# Altium schematic sheet STlink-V3EC.SchDoc: STLINK-V3EC
size A3; Date: Not used; ApprovedBy: Not used; CheckedBy: Not used; Author: Not used; CompanyName: STMicroelectronics; DrawnBy: Not used; Engineer: Not used; Organization: Not used; Address1: Not used; Address2: Not used; Address3: Not used; Address4: Not used; DocumentNumber: Not used; Revision: Not used; SheetNumber: 6; SheetTotal: 7; CurrentTime: Not used; CurrentDate: Not used; Time: Not used; DocumentFullPathAndName: Not used; DocumentName: Not used; ModifiedDate: Not used; ImagePath: Not used; ProjectName: Not used; Application_BuildNumber: Not used
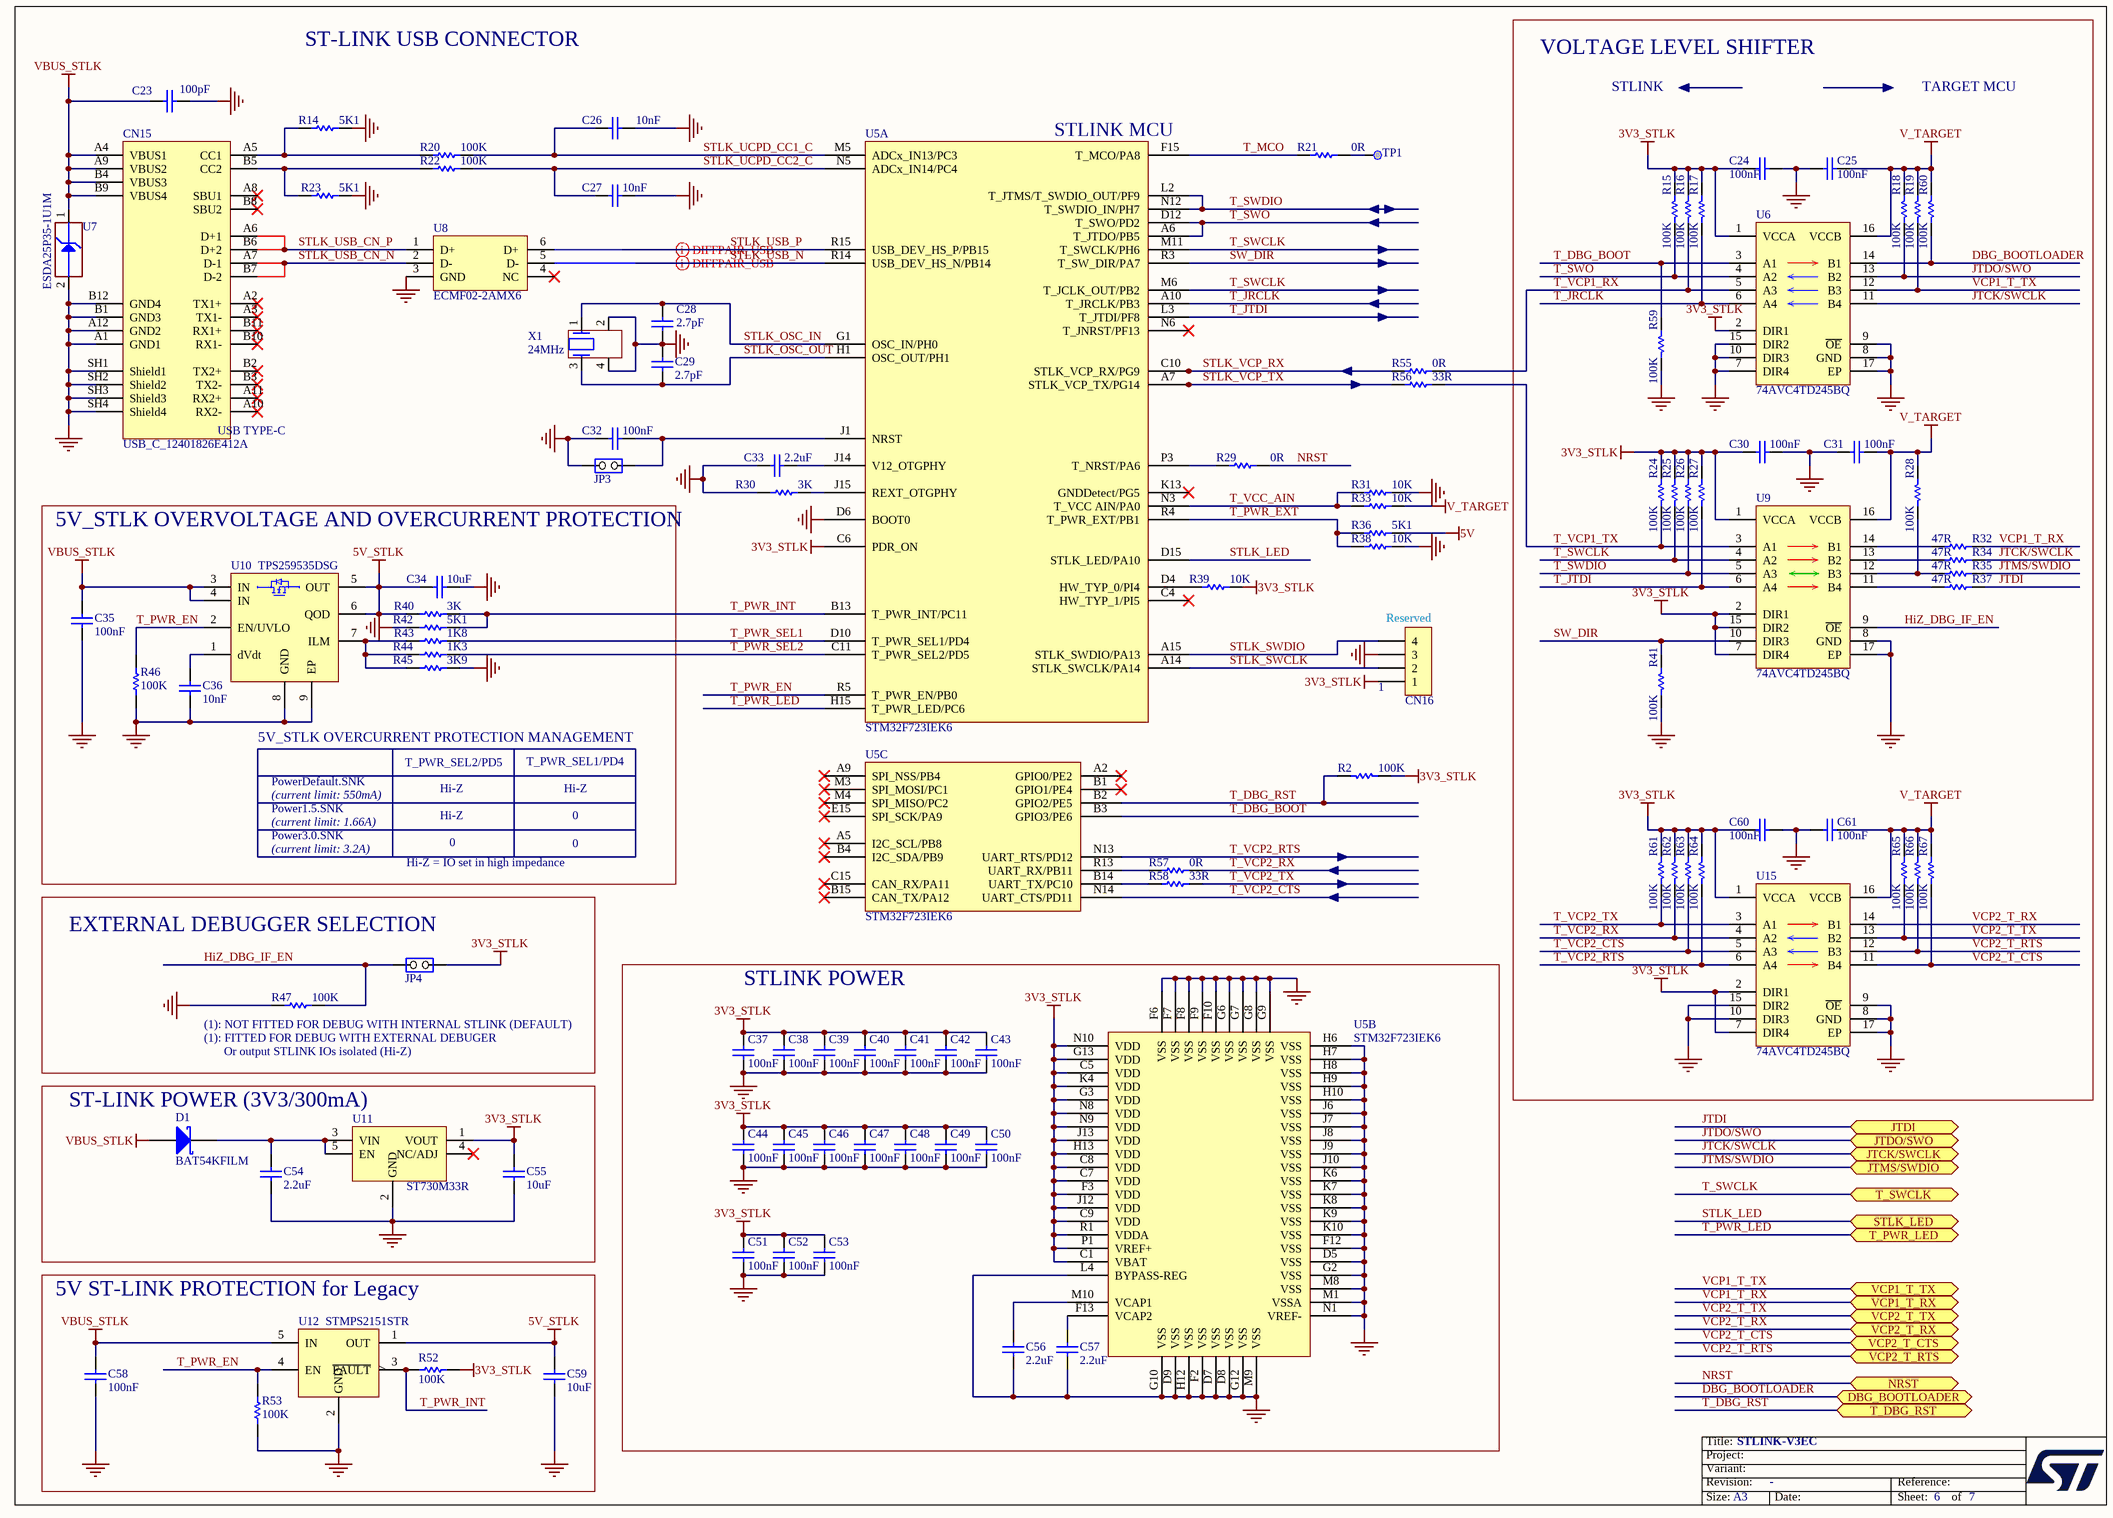
[diagram p0: STlink-V3EC.SchDoc]

## Parts
C23  value 100pF  [C0402]  (hidden comment: Capacitor)
C24  value 100nF  [C0402]  (hidden comment: Capacitor)
C25  value 100nF  [C0402]  (hidden comment: Capacitor)
C26  value 10nF  [C0402]  (hidden comment: Capacitor)
C27  value 10nF  [C0402]  (hidden comment: Capacitor)
C28  value 2.7pF  [C0402]  (hidden comment: Capacitor)
C29  value 2.7pF  [C0402]  (hidden comment: Capacitor)
C30  value 100nF  [C0402]  (hidden comment: Capacitor)
C31  value 100nF  [C0402]  (hidden comment: Capacitor)
C32  value 100nF  [C0402]  (hidden comment: Capacitor)
C33  value 2.2uF  [C0402]  (hidden comment: Capacitor)
C34  value 10uF  [C0603]  (hidden comment: Capacitor)
C35  value 100nF  [C0402]  (hidden comment: Capacitor)
C36  value 10nF  [C0402]  (hidden comment: Capacitor)
C37  value 100nF  [C0402]  (hidden comment: Capacitor)
C38  value 100nF  [C0402]  (hidden comment: Capacitor)
C39  value 100nF  [C0402]  (hidden comment: Capacitor)
C40  value 100nF  [C0402]  (hidden comment: Capacitor)
C41  value 100nF  [C0402]  (hidden comment: Capacitor)
C42  value 100nF  [C0402]  (hidden comment: Capacitor)
C43  value 100nF  [C0402]  (hidden comment: Capacitor)
C44  value 100nF  [C0402]  (hidden comment: Capacitor)
C45  value 100nF  [C0402]  (hidden comment: Capacitor)
C46  value 100nF  [C0402]  (hidden comment: Capacitor)
C47  value 100nF  [C0402]  (hidden comment: Capacitor)
C48  value 100nF  [C0402]  (hidden comment: Capacitor)
C49  value 100nF  [C0402]  (hidden comment: Capacitor)
C50  value 100nF  [C0402]  (hidden comment: Capacitor)
C51  value 100nF  [C0402]  (hidden comment: Capacitor)
C52  value 100nF  [C0402]  (hidden comment: Capacitor)
C53  value 100nF  [C0402]  (hidden comment: Capacitor)
C54  value 2.2uF  [C0805]  (hidden comment: Capacitor)
C55  value 10uF  [C0603]  (hidden comment: Capacitor)
C56  value 2.2uF  [C0402]  (hidden comment: Capacitor)
C57  value 2.2uF  [C0402]  (hidden comment: Capacitor)
C58  value 100nF  [C0402]  (hidden comment: Capacitor)
C59  value 10uF  [C0603]  (hidden comment: Capacitor)
C60  value 100nF  [C0402]  (hidden comment: Capacitor)
C61  value 100nF  [C0402]  (hidden comment: Capacitor)
CN15  value USB_C_12401826E412A  [CON_USB-TYPEC_AMPHENOL_12401826E412A]  (hidden comment: USB_TYPE_C_Receptacle)
CN16  Header 4x1  [CON_SAMTEC_TSW-104-07-G-S]  (value not drawn)
D1  value BAT54KFILM  [DIO_SOD523_1A_2K]  (hidden comment: SCHOTTKY_1A_2K)
JP3  Jumper_Header 2x1  [CON_SAMTEC_TSW-102-07-G-S]  (value not drawn)
JP4  Jumper_Header 2x1  [CON_SAMTEC_TSW-102-07-G-S]  (value not drawn)
R2  value 100K  [R0402]  (hidden comment: Resistor)
R14  value 5K1  [R0402]  (hidden comment: Resistor)
R15  value 100K  [R0402]  (hidden comment: Resistor)
R16  value 100K  [R0402]  (hidden comment: Resistor)
R17  value 100K  [R0402]  (hidden comment: Resistor)
R18  value 100K  [R0402]  (hidden comment: Resistor)
R19  value 100K  [R0402]  (hidden comment: Resistor)
R20  value 100K  [R0402]  (hidden comment: Resistor)
R21  value 0R  [R0402]  (hidden comment: Resistor)
R22  value 100K  [R0402]  (hidden comment: Resistor)
R23  value 5K1  [R0402]  (hidden comment: Resistor)
R24  value 100K  [R0402]  (hidden comment: Resistor)
R25  value 100K  [R0402]  (hidden comment: Resistor)
R26  value 100K  [R0402]  (hidden comment: Resistor)
R27  value 100K  [R0402]  (hidden comment: Resistor)
R28  value 100K  [R0402]  (hidden comment: Resistor)
R29  value 0R  [R0402]  (hidden comment: Resistor)
R30  value 3K  [R0402]  (hidden comment: Resistor)
R31  value 10K  [R0402]  (hidden comment: Resistor)
R32  value 47R  [R0402]  (hidden comment: Resistor)
R33  value 10K  [R0402]  (hidden comment: Resistor)
R34  value 47R  [R0402]  (hidden comment: Resistor)
R35  value 47R  [R0402]  (hidden comment: Resistor)
R36  value 5K1  [R0402]  (hidden comment: Resistor)
R37  value 47R  [R0402]  (hidden comment: Resistor)
R38  value 10K  [R0402]  (hidden comment: Resistor)
R39  value 10K  [R0402]  (hidden comment: Resistor)
R40  value 3K  [R0402]  (hidden comment: Resistor)
R41  value 100K  [R0402]  (hidden comment: Resistor)
R42  value 5K1  [R0402]  (hidden comment: Resistor)
R43  value 1K8  [R0402]  (hidden comment: Resistor)
R44  value 1K3  [R0402]  (hidden comment: Resistor)
R45  value 3K9  [R0402]  (hidden comment: Resistor)
R46  value 100K  [R0402]  (hidden comment: Resistor)
R47  value 100K  [R0402]  (hidden comment: Resistor)
R52  value 100K  [R0402]  (hidden comment: Resistor)
R53  value 100K  [R0402]  (hidden comment: Resistor)
R55  value 0R  [R0402]  (hidden comment: Resistor)
R56  value 33R  [R0402]  (hidden comment: Resistor)
R57  value 0R  [R0402]  (hidden comment: Resistor)
R58  value 33R  [R0402]  (hidden comment: Resistor)
R59  value 100K  [R0402]  (hidden comment: Resistor)
R60  value 100K  [R0402]  (hidden comment: Resistor)
R61  value 100K  [R0402]  (hidden comment: Resistor)
R62  value 100K  [R0402]  (hidden comment: Resistor)
R63  value 100K  [R0402]  (hidden comment: Resistor)
R64  value 100K  [R0402]  (hidden comment: Resistor)
R65  value 100K  [R0402]  (hidden comment: Resistor)
R66  value 100K  [R0402]  (hidden comment: Resistor)
R67  value 100K  [R0402]  (hidden comment: Resistor)
TP1  Test Point  [TP_SMD_1MM]  (value not drawn)  (no BOM)
U5  value STM32F723IEK6  [ICC_UFBGA201_176+25_10X10_P065]  (hidden comment: STLINK-V3EC_Old)  (parts A,B,C of 3)
U6  74AVC4TD245BQ  [ICC_DHVQFN16-EPAD_SOT763-1_2P5X3P5_H0P85_P050]
U7  value ESDA25P35-1U1M  [ESD_QFN1610_2N_1K_2A]  (hidden comment: ESD-TRANSIL)
U8  ECMF02-2AMX6  [ESD_QFN-6L_1P7X1P5_P050]
U9  74AVC4TD245BQ  [ICC_DHVQFN16-EPAD_SOT763-1_2P5X3P5_H0P85_P050]
U10  TPS259535DSG  [ICC_WSON8-EPAD_2X2_P050]
U11  ST730M33R  [ICC_SOT23-5L_H1P45]
U12  STMPS2151STR  [MOS_SOT23-5L]
U15  74AVC4TD245BQ  [ICC_DHVQFN16-EPAD_SOT763-1_2P5X3P5_H0P85_P050]
X1  value 24MHz  [CRY_NX2016SA_4P]  (hidden comment: XTAL_4_PINS)

## Blocks framed on the sheet
VOLTAGE LEVEL SHIFTER: C24 C25 C30 C31 C60 C61 R15-R19 R24-R28 R32 R34 R35 R37 R41 R59-R67 U6 U9 U15
5V_STLK OVERVOLTAGE AND OVERCURRENT PROTECTION: C34-C36 R40 R42-R46 U10
EXTERNAL DEBUGGER SELECTION: JP4 R47
STLINK POWER: C37-C53 C56 C57 U5
ST-LINK POWER (3V3/300mA): C54 C55 D1 U11
5V ST-LINK PROTECTION for Legacy: C58 C59 R52 R53 U12

## Ports
DBG_BOOTLOADER (bidir), JTCK/SWCLK (bidir), JTDI (bidir), JTDO/SWO (bidir), JTMS/SWDIO (bidir), NRST (bidir), STLK_LED (bidir), T_DBG_RST (bidir), T_PWR_LED (bidir), T_SWCLK (bidir), VCP1_T_RX (bidir), VCP1_T_TX (bidir), VCP2_T_CTS (bidir), VCP2_T_RTS (bidir), VCP2_T_RX (bidir), VCP2_T_TX (bidir)

## Nets
3V3_STLK: C24.2 C30.2 C37.1 C38.1 C39.1 C40.1 C41.1 C42.1 C43.1 C44.1 C45.1 C46.1 C47.1 C48.1 C49.1 C50.1 C51.1 C52.1 C53.1 C55.2 C60.2 CN16.1 JP4.1(COMMON) R2.1 R15.2 R16.2 R17.2 R24.1 R25.2 R26.2 R27.2 R39.2 R52.1 R61.2 R62.2 R63.2 R64.2 U5.C1(VBAT) U5.C5(VDD) U5.C6(PDR_ON) U5.C7(VDD) U5.C8(VDD) U5.C9(VDD) U5.F3(VDD) U5.G3(VDD) U5.G13(VDD) U5.H13(VDD) U5.J12(VDD) U5.J13(VDD) U5.K4(VDD) U5.N8(VDD) U5.N9(VDD) U5.N10(VDD) U5.P1(VREF+) U5.R1(VDDA) U6.1(VCCA) U6.2(DIR1) U9.1(VCCA) U9.2(DIR1) U9.7(DIR4) U9.15(DIR2) U11.1(VOUT) U15.1(VCCA) U15.2(DIR1) U15.7(DIR4)
5V: R36.2
5V_STLK: C34.2 C59.2 R40.1 U10.5(OUT) U10.6(QOD) U12.1(OUT)
GND: C23.2 C24.1 C25.2 C26.2 C27.2 C28.1 C29.2 C30.1 C31.2 C32.1 C33.1 C34.1 C35.1 C36.1 C37.2 C38.2 C39.2 C40.2 C41.2 C42.2 C43.2 C44.2 C45.2 C46.2 C47.2 C48.2 C49.2 C50.2 C51.2 C52.2 C53.2 C54.1 C55.1 C56.1 C57.1 C58.1 C59.1 C60.1 C61.2 CN15.A1(GND1) CN15.A12(GND2) CN15.B1(GND3) CN15.B12(GND4) CN15.SH1(Shield1) CN15.SH2(Shield2) CN15.SH3(Shield3) CN15.SH4(Shield4) CN16.3 JP3.2(NO) R14.2 R23.2 R30.2 R31.2 R38.2 R41.1 R42.1 R45.2 R46.1 R47.1 R53.1 R59.1 U5.D5(VSS) U5.D6(BOOT0) U5.D7(VSS) U5.D8(VSS) U5.D9(VSS) U5.F2(VSS) U5.F6(VSS) U5.F7(VSS) U5.F8(VSS) U5.F9(VSS) U5.F10(VSS) U5.F12(VSS) U5.G2(VSS) U5.G6(VSS) U5.G7(VSS) U5.G8(VSS) U5.G9(VSS) U5.G10(VSS) U5.G12(VSS) U5.H6(VSS) U5.H7(VSS) U5.H8(VSS) U5.H9(VSS) U5.H10(VSS) U5.H12(VSS) U5.J6(VSS) U5.J7(VSS) U5.J8(VSS) U5.J9(VSS) U5.J10(VSS) U5.K6(VSS) U5.K7(VSS) U5.K8(VSS) U5.K9(VSS) U5.K10(VSS) U5.L4(BYPASS-REG) U5.M1(VSSA) U5.M8(VSS) U5.M9(VSS) U5.N1(VREF-) U6.7(DIR4) U6.8(GND) U6.9(~{OE}) U6.10(DIR3) U6.15(DIR2) U6.17(EP) U7.2(GND) U8.3(GND) U9.8(GND) U9.17(EP) U10.8(GND) U10.9(EP) U11.2(GND) U12.2(GND) U15.8(GND) U15.9(~{OE}) U15.10(DIR3) U15.15(DIR2) U15.17(EP) X1.2 X1.4
V_TARGET: C25.1 C31.1 C61.1 R18.2 R19.2 R28.2 R33.2 R60.2 R65.2 R66.2 R67.2 U6.16(VCCB) U9.16(VCCB) U15.16(VCCB)
VBUS_STLK: C23.1 C35.2 C58.2 CN15.A4(VBUS1) CN15.A9(VBUS2) CN15.B4(VBUS3) CN15.B9(VBUS4) D1.1(A) U7.1(IO1) U10.3(IN) U10.4(IN) U12.5(IN)
DBG_BOOTLOADER: R60.1 U6.14(B1) ; port DBG_BOOTLOADER
HiZ_DBG_IF_EN: JP4.2(NO) R47.2 U9.9(~{OE})
JTCK/SWCLK: R34.2 U6.11(B4) ; port JTCK/SWCLK
JTDI: R37.2 ; port JTDI
JTDO/SWO: R18.1 U6.13(B2) ; port JTDO/SWO
JTMS/SWDIO: R35.2 ; port JTMS/SWDIO
NRST: R29.2 ; port NRST
STLK_LED: U5.D15(STLK_LED/PA10) ; port STLK_LED
STLK_OSC_IN: C28.2 U5.G1(OSC_IN/PH0) X1.1
STLK_OSC_OUT: C29.1 U5.H1(OSC_OUT/PH1) X1.3
STLK_SWCLK: CN16.2 U5.A14(STLK_SWCLK/PA14)
STLK_SWDIO: CN16.4 U5.A15(STLK_SWDIO/PA13)
STLK_UCPD_CC1_C: C26.1 R20.2 U5.M5(ADCx_IN13/PC3)
STLK_UCPD_CC2_C: C27.1 R22.2 U5.N5(ADCx_IN14/PC4)
STLK_USB_CN_N: CN15.A7(D-1) CN15.B7(D-2) U8.2(D-)
STLK_USB_CN_P: CN15.A6(D+1) CN15.B6(D+2) U8.1(D+)
STLK_USB_N: U5.R14(USB_DEV_HS_N/PB14) U8.5(D-)
STLK_USB_P: U5.R15(USB_DEV_HS_P/PB15) U8.6(D+)
STLK_VCP_RX: R55.1 U5.C10(STLK_VCP_RX/PG9)
STLK_VCP_TX: R56.1 U5.A7(STLK_VCP_TX/PG14)
SW_DIR: R41.2 U5.R3(T_SW_DIR/PA7) U9.10(DIR3)
T_DBG_BOOT: R59.2 U5.B3(GPIO3/PE6) U6.3(A1)
T_DBG_RST: R2.2 U5.B2(GPIO2/PE5) ; port T_DBG_RST
T_JRCLK: R17.1 U5.A10(T_JRCLK/PB3) U6.6(A4)
T_JTDI: R27.1 U5.L3(T_JTDI/PF8) U9.6(A4)
T_MCO: R21.1 U5.F15(T_MCO/PA8)
T_PWR_EN: R46.2 R53.2 U5.R5(T_PWR_EN/PB0) U10.2(EN/UVLO) U12.4(EN)
T_PWR_EXT: R36.1 R38.1 U5.R4(T_PWR_EXT/PB1)
T_PWR_INT: R40.2 R42.2 R52.2 U5.B13(T_PWR_INT/PC11) U12.3(~{FAULT})
T_PWR_LED: U5.H15(T_PWR_LED/PC6) ; port T_PWR_LED
T_PWR_SEL1: R43.2 U5.D10(T_PWR_SEL1/PD4)
T_PWR_SEL2: R44.2 U5.C11(T_PWR_SEL2/PD5)
T_SWCLK: R25.1 U5.M6(T_JCLK_OUT/PB2) U5.M11(T_SWCLK/PH6) U9.4(A2) ; port T_SWCLK
T_SWDIO: R26.1 U5.L2(T_JTMS/T_SWDIO_OUT/PF9) U5.N12(T_SWDIO_IN/PH7) U9.5(A3)
T_SWO: R15.1 U5.A6(T_JTDO/PB5) U5.D12(T_SWO/PD2) U6.4(A2)
T_VCC_AIN: R31.1 R33.1 U5.N3(T_VCC_AIN/PA0)
T_VCP1_RX: R16.1 R55.2 U6.5(A3)
T_VCP1_TX: R24.2 R56.2 U9.3(A1)
T_VCP2_CTS: R63.1 U5.N14(UART_CTS/PD11) U15.5(A3)
T_VCP2_RTS: R64.1 U5.N13(UART_RTS/PD12) U15.6(A4)
T_VCP2_RX: R57.2 R62.1 U15.4(A2)
T_VCP2_TX: R58.2 R61.1 U15.3(A1)
VCP1_T_RX: R32.2 ; port VCP1_T_RX
VCP1_T_TX: R19.1 U6.12(B3) ; port VCP1_T_TX
VCP2_T_CTS: R67.1 U15.11(B4) ; port VCP2_T_CTS
VCP2_T_RTS: R66.1 U15.12(B3) ; port VCP2_T_RTS
VCP2_T_RX: U15.14(B1) ; port VCP2_T_RX
VCP2_T_TX: R65.1 U15.13(B2) ; port VCP2_T_TX
NetC32_2: C32.2 JP3.1(COMMON) U5.J1(NRST)
NetC33_2: C33.2 U5.J14(V12_OTGPHY)
NetC36_2: C36.2 U10.1(dVdt)
NetC54_2: C54.2 D1.2(K) U11.3(VIN) U11.5(EN)
NetC56_2: C56.2 U5.M10(VCAP1)
NetC57_2: C57.2 U5.F13(VCAP2)
NetCN15_A5: CN15.A5(CC1) R14.1 R20.1
NetCN15_B5: CN15.B5(CC2) R22.1 R23.1
NetR21_2: R21.2 TP1.1
NetR28_1: R28.1 R35.1 U9.12(B3)
NetR29_1: R29.1 U5.P3(T_NRST/PA6)
NetR30_1: R30.1 U5.J15(REXT_OTGPHY)
NetR32_1: R32.1 U9.14(B1)
NetR34_1: R34.1 U9.13(B2)
NetR37_1: R37.1 U9.11(B4)
NetR39_1: R39.1 U5.D4(HW_TYP_0/PI4)
NetR43_1: R43.1 R44.1 R45.1 U10.7(ILM)
NetR57_1: R57.1 U5.R13(UART_RX/PB11)
NetR58_1: R58.1 U5.B14(UART_TX/PC10)

Not connected (* = marked no-connect by the designer): CN15 A2(TX1+)* A3(TX1-)* A8(SBU1)* A10(RX2-)* A11(RX2+)* B2(TX2+)* B3(TX2-)* B8(SBU2)* B10(RX1-)* B11(RX1+)*; U5 A2(GPIO0/PE2)* A5(I2C_SCL/PB8)* A9(SPI_NSS/PB4)* B1(GPIO1/PE4)* B4(I2C_SDA/PB9)* B15(CAN_TX/PA12)* C4(HW_TYP_1/PI5)* C15(CAN_RX/PA11)* E15(SPI_SCK/PA9)* K13(GNDDetect/PG5)* M3(SPI_MOSI/PC1)* M4(SPI_MISO/PC2)* N6(T_JNRST/PF13)*; U8 4(NC)*; U11 4(NC/ADJ)*

## Layout directives
differential pair; rule Impedance Constraint [Min = 85.00    Max = 95.00    ]: STLK_USB_N, STLK_USB_P

## Notes on the sheet
- ST-LINK USB CONNECTOR
- STLINK
- TARGET MCU
- (near U5) STLINK MCU
- (near CN16) Reserved
- (near CN16) 1
- 5V_STLK OVERCURRENT PROTECTION MANAGEMENT
- PowerDefault.SNK
- T_PWR_SEL2/PD5
- T_PWR_SEL1/PD4
- (current limit: 550mA)
- (current limit: 1.66A)
- (current limit: 3.2A)
- Power1.5.SNK
- Power3.0.SNK
- Hi-Z
- 0
- Hi-Z = IO set in high impedance
- (near R47) (1): NOT FITTED FOR DEBUG WITH INTERNAL STLINK (DEFAULT)
- (near R47) (1): FITTED FOR DEBUG WITH EXTERNAL DEBUGER
- (near R47) Or output STLINK IOs isolated (Hi-Z)
- Title:
- Project:
- Size:
- Revision:
- Variant:
- A3
- -
- Date:
- Reference:
- Sheet:
- of
- (in symbol MCD-03232) USB TYPE-C

## Library data of the parts
C23 = MCD-00205: Capacitor, MLCC, 100pF, 50V, NPO, +/-5%, 0402, T=0.5mm; Part_Preference: Recommended; Manufacturer: YAGEO; Manufacturer_Part_Number: CC0402JRNPO9BN101; Component_Country_Of_Origin: China; Internal_Part_Number: MCD-00205; Status: Released; Part_Type: Capacitor; Package: 0402; ComponentLink1URL: http://tunmcdsvn.tun.st.com/Component_Documentation_Library/Trunk/Capacitor/YAGEO_NP0_Series; Order_Code_Digikey: 311-1024-1-ND; Order_Code_Farnell: 3019226RL; Order_Code_RS: N/A
C24 C25 C30-C32 C37-C53 C60 C61 = MCD-00006: Capacitor, MLCC, 100nF, 16V, X7R, 10%, 0402, T=0.5mm; Manufacturer_Part_Number: CC0402KRX7R7BB104; Manufacturer: YAGEO; Alternate_Manufacturer_Part_Number: GCM155R71C104KA55D; Alternate_Manufacturer: MURATA; Provided_By: SUBCO; Internal_Part_Number: MCD-00006; ComponentLink1Description: Datasheet; Status: Released; Package: C0402; Part_Type: Capacitor; ComponentLink1URL: http://tunmcdsvn.tun.st.com/Component_Datasheet_Library/Trunk/Capacitors/Yageo_Multilayer_Capacitor_X7R_series_100pF_to_22uF
C26 C27 C36 = MCD-02198: Capacitor, MLCC, 10nF, 50V, X7R, +/-10%, 0402, T=0.5mm; Part_Preference: Recommended; Manufacturer: YAGEO; Manufacturer_Part_Number: CC0402KRX7R9BB103; Order_Code_RS: 6169644; Component_Country_Of_Origin: China; Internal_Part_Number: MCD-02198; Status: Checked; Part_Type: Capacitor; Package: 0402; ComponentLink1URL: http://tunmcdsvn.tun.st.com/Component_Documentation_Library/Trunk/Capacitor/YAGEO_X7R_Series; Order_Code_Digikey: N/A; Order_Code_Farnell: N/A
C28 C29 = MCD-01774: Capacitor, MLCC, 2.7pF, 50V, NPO, +/-0.1pF, 0402, T=0.5mm; Part_Preference: Recommended; Manufacturer: YAGEO; Manufacturer_Part_Number: CC0402BRNPO9BN2R7; Component_Country_Of_Origin: China; Internal_Part_Number: MCD-01774; Status: Released; Part_Type: Capacitor; Package: 0402; ComponentLink1URL: http://tunmcdsvn.tun.st.com/Component_Documentation_Library/Trunk/Capacitor/YAGEO_NP0_Series; Order_Code_Digikey: 311-1619-1-ND; Order_Code_Farnell: N/A; Order_Code_RS: N/A
C33 C56 C57 = MCD-02606: Capacitor, MLCC, 2.2uF, 6.3V, X5R, +/-10%, 0402, T=0.5mm; Part_Preference: Recommended; Manufacturer: YAGEO; Manufacturer_Part_Number: CC0402KRX5R5BB225; Order_Code_RS: 1992205; Internal_Part_Number: MCD-02606; Status: New; Part_Type: Capacitor; Package: 0402; ComponentLink1URL: http://tunmcdsvn.tun.st.com/Component_Documentation_Library/Trunk/Capacitor/YAGEO_X5R_Series; Order_Code_Digikey: 311-1682-2-ND; Order_Code_Farnell: 3366429
C34 C55 = MCD-00099: Capacitor, MLCC, 10uF, 10V, X5R, +/-10%, 0603, T=0.8mm; Part_Preference: Recommended; Manufacturer: MURATA; Manufacturer_Part_Number: GRM188R61A106KE69D; Order_Code_RS: 170-6168; Component_Country_Of_Origin: Japan; Internal_Part_Number: MCD-00099; Status: Released; Part_Type: Capacitor; Package: 0603; ComponentLink1URL: http://tunmcdsvn.tun.st.com/Component_Documentation_Library/Trunk/Capacitor/MURATA_GRM_Series; Order_Code_Digikey: 490-10474-1-ND; Order_Code_Farnell: 2494233
C35 = MCD-02355: Capacitor, MLCC, 100nF, 25V, X7R, +/-10%, 0402, T=0.5mm; Part_Preference: Recommended; Manufacturer: WALSIN; Manufacturer_Part_Number: 0402B104K250CT; Order_Code_RS: 176-3114; Component_Country_Of_Origin: Unknown; Internal_Part_Number: MCD-02355; Status: Checked; Part_Type: Capacitor; Package: 0402; ComponentLink1URL: http://tunmcdsvn.tun.st.com/Component_Documentation_Library/Trunk/Capacitor/WALSIN_Monolithic_Series/; Order_Code_Digikey: 1292-1175-1-ND; Order_Code_Farnell: 2496772
C54 = MCD-02372: Capacitor, MLCC, 2.2uF, 25V, X7R, +/-10%, 0805, T=1,25mm; Manufacturer_Part_Number: GRM21BR71E225KE11L; Manufacturer: MURATA; Part_Preference: Recommended; ECCN_US: EAR99; ECCN_EU: NEC; Provided_By: SUBCO; Internal_Part_Number: MCD-02372; Status: Checked; Part_Type: Capacitor; Alternate_Manufacturer_Part_Number: N/A; Alternate_Manufacturer: N/A; Package: C0805; ComponentLink1Description: Datasheet; ComponentLink1URL: http://tunmcdsvn.tun.st.com/Component_Documentation_Library/Trunk/Capacitor/MURATA_GRM_Series/GRM21BR71E225KE11; Order_Code_Digikey: 490-14467; Order_Code_Farnell: 2688538; Order_Code_RS: N/A
C58 = MCD-02355: Capacitor, MLCC, 100nF, 25V, X7R, +/-10%, 0402, T=0.5mm; Part_Preference: Recommended; Manufacturer: WALSIN; Manufacturer_Part_Number: 0402B104K250CT; Order_Code_RS: 176-3114; Component_Country_Of_Origin: Unknown; ShowFields: YES; ID: 4461; Internal_Part_Number: MCD-02355; Status: Released; Part_Type: Capacitor; Package: 0402; ComponentLink1URL: http://tunmcdsvn.tun.st.com/Component_Documentation_Library/Trunk/Capacitor/WALSIN_Monolithic_Series/; Order_Code_Digikey: 1292-1175-1-ND; Order_Code_Farnell: 2496772
C59 = MCD-00099: Capacitor, MLCC, 10uF, 10V, X5R, +/-10%, 0603, T=0.8mm; Part_Preference: Recommended; Manufacturer: MURATA; Manufacturer_Part_Number: GRM188R61A106KE69D; Order_Code_RS: 170-6168; Component_Country_Of_Origin: Japan; ShowFields: YES; ID: 2770; Internal_Part_Number: MCD-00099; Status: Released; Part_Type: Capacitor; Package: 0603; ComponentLink1URL: http://tunmcdsvn.tun.st.com/Component_Documentation_Library/Trunk/Capacitor/MURATA_GRM_Series; Order_Code_Digikey: 490-10474-1-ND; Order_Code_Farnell: 2494233
CN15 = MCD-03232: USB_TypeC, 24 pins, RA, SMD, T=2.96mm; Part_Type: Connector; Part_Preference: Recommended; Manufacturer: AMPHENOL ICC; Manufacturer_Part_Number: 12401826E412A; Component_Country_Of_Origin: China°; ShowFields: YES; ID: 5348; Internal_Part_Number: MCD-03232; Status: Released; ComponentLink1URL: http://tunmcdsvn.tun.st.com/Component_Documentation_Library/Trunk/Connector/AMPHEMOL_ICC_12401826E412A; Order_Code_Digikey: 12401826E412ATR-ND; Order_Code_Farnell: 3727763; Order_Code_RS: N/A
CN16 = MCD-00029: Header, 4x1, 2,54mm, VR, TH, Height 5.84mm/2.54mm; Manufacturer_Part_Number: TSW-104-07-x-S; Manufacturer: SAMTEC; Part_Type: Connector; Provided_By: SUBCO; Internal_Part_Number: MCD-00029; Status: Released; ComponentLink1Description: Datasheet; ComponentLink1URL: http://tunmcdsvn.tun.st.com/Component_Datasheet_Library/Trunk/Connectors/Samtec_TSW-HTSW-series
D1 = MCD-01677: Small signal Schottky diodes; BMS_Part_Number: 9151123; Part_Type: Diode; Part_Preference: Recommended; Manufacturer: STMICROELECTRONICS; Manufacturer_HQ_COO: EU; Component_Country_Of_Origin: China; ShowFields: YES; ID: 3777; Internal_Part_Number: MCD-01677; Status: Checked; Manufacturer_Part_Number: BAT54KFILM; Package: SOD-523; ComponentLink1URL: http://tunmcdsvn.tun.st.com/Component_Datasheet_Library/Trunk/Diodes/STM_SCHOTTKY_DOUBLE_BAT54SWFILM/STM_SCHOTTKY_DOUBLE_BAT54SWFILM.pdf
JP3 JP4 = MCD-00045: Header, 2x1, 2,54mm, VR, TH, Height 5.84mm/2.54mm; Part_Preference: Recommended; Part_Type: Connector; Manufacturer: SAMTEC; Manufacturer_Part_Number: TSW-102-07-G-S; Alternate_Manufacturer: JIUBABA; LIANYI; Alternate_Manufacturer_Part_Number: 313102S111116;313102S111116; Internal_Part_Number: MCD-00045; Status: Released; ComponentLink1Description: Datasheet; ComponentLink1URL: http://tunmcdsvn.tun.st.com/Component_Datasheet_Library/Trunk/Connectors/Samtec_TSW-HTSW-series
R2 R15-R19 R24-R28 R41 R59-R67 = MCD-00059: Resistor,100K,0402,1%,1/16W; Manufacturer_Part_Number: RC0402FR-07100KL; Manufacturer: YAGEO; Alternate_Manufacturer_Part_Number: RT0402FRE07100KL; Provided_By: Subcon; Initial_Board_Reference: MB1274; Internal_Part_Number: MCD-00059; Status: Released; ComponentLink1Description: Yageo_Resistor_RC0402-series.pdf; ECCN_US: n/a; ECCN_EU: n/a; Alternate_Manufacturer: YAGEO; Part_Type: Resistor; Package: R0402; ComponentLink1URL: http://tunmcdsvn.tun.st.com/Component_Datasheet_Library/Trunk/Resistors/Yageo_Resistor_RC0402-series
R14 R23 R36 R42 = MCD-00333: Resistor, 5K1, 0402, +/-1%, 1/16W; Part_Preference: Recommended; Manufacturer: YAGEO; Manufacturer_Part_Number: RC0402FR-075K1L; Internal_Part_Number: MCD-00333; Status: Released; Part_Type: Resistor; Alternate_Manufacturer: N/A; Alternate_Manufacturer_Part_Number: N/A; Package: 0402; ComponentLink1URL: http://tunmcdsvn.tun.st.com/Component_Documentation_Library/Trunk/Resistor/YAGEO_RC_L_Series; Order_Code_Digikey: 311-5.10KLRCT-ND; Order_Code_Farnell: 1458805; Order_Code_RS: N/A
R20 R22 R46 R47 R52 R53 = MCD-00059: Resistor, 100K, 0402, +/-1%, 1/16W; Part_Preference: Recommended; Manufacturer: YAGEO; Manufacturer_Part_Number: RC0402FR-07100KL; Component_Country_Of_Origin: China; ShowFields: YES; ID: 2533; Internal_Part_Number: MCD-00059; Status: Released; Part_Type: Resistor; Package: 0402; ComponentLink1URL: http://tunmcdsvn.tun.st.com/Component_Documentation_Library/Trunk/Resistor/YAGEO_RC_L_Series; Order_Code_Digikey: 311-100KLRTR-ND; Order_Code_Farnell: 2421891; Order_Code_RS: N/A
R21 R29 R55 R57 = MCD-00052: Resistor, 0R, 0402, +/-5%, 1/16W; Part_Preference: Recommended; Manufacturer: YAGEO; Manufacturer_Part_Number: RC0402JR-070RL; Order_Code_RS: 618-5804; Component_Country_Of_Origin: China; Internal_Part_Number: MCD-00052; Status: Released; Part_Type: Resistor; Package: 0402; ComponentLink1URL: http://tunmcdsvn.tun.st.com/Component_Documentation_Library/Trunk/Resistor/YAGEO_RC_L_Series; Order_Code_Digikey: 311-0.0JRCT-ND; Order_Code_Farnell: 9232516RL
R30 = MCD-00185: Resistor,3K,0402,1%,1/16W; Manufacturer_Part_Number: RC0402FR-073KL; Manufacturer: YAGEO; Provided_By: SUBCO; Internal_Part_Number: MCD-00185; Status: Released; ComponentLink1Description: Datasheet; Part_Type: Resistor; ComponentLink1URL: http://tunmcdsvn.tun.st.com/Component_Datasheet_Library/Trunk/Resistors/Yageo_Resistor_RC0402-series; Package: R0402
R31 R33 R38 R39 = MCD-00053: Resistor,10K,0402,1%,1/16W; Manufacturer_Part_Number: RC0402FR-0710KL; Manufacturer: YAGEO; Provided_By: SUBCO; Internal_Part_Number: MCD-00053; Status: Released; ComponentLink1Description: Datasheet; Part_Type: Resistor; ComponentLink1URL: http://tunmcdsvn.tun.st.com/Component_Datasheet_Library/Trunk/Resistors/Yageo_Resistor_RC0402-series; Package: R0402
R32 R34 R35 R37 = MCD-00481: Resistor,47R,0402,1%,1/16W; Manufacturer_Part_Number: RC0402FR-0747RL; Manufacturer: YAGEO; Provided_By: SUBCO; Initial_Board_Reference: MBxxxx; Internal_Part_Number: MCD-00481; Status: Released; Part_Type: Resistor; Package: R0402; ComponentLink1Description: Datasheet; ComponentLink1URL: http://tunmcdsvn.tun.st.com/Component_Datasheet_Library/Trunk/Resistors/Yageo_Resistor_RC0402-series
R40 = MCD-00185: Resistor, 3K, 0402, +/-1%, 1/16W; Part_Preference: Recommended; Manufacturer: YAGEO; Manufacturer_Part_Number: RC0402FR-073KL; Component_Country_Of_Origin: China; Internal_Part_Number: MCD-00185; Status: Released; Part_Type: Resistor; Package: 0402; ComponentLink1URL: http://tunmcdsvn.tun.st.com/Component_Documentation_Library/Trunk/Resistor/YAGEO_RC_L_Series; Order_Code_Digikey: 311-3KLRCT-ND; Order_Code_Farnell: 1458777; Order_Code_RS: N/A
R43 = MCD-00409: Resistor, 1K8, 0402, +/-1%, 1/16W; Part_Preference: Recommended; Manufacturer: YAGEO; Manufacturer_Part_Number: RC0402FR-071K8L; Component_Country_Of_Origin: China; Internal_Part_Number: MCD-00409; Status: Released; Part_Type: Resistor; Package: 0402; ComponentLink1URL: http://tunmcdsvn.tun.st.com/Component_Documentation_Library/Trunk/Resistor/YAGEO_RC_L_Series; Order_Code_Digikey: 311-1.80KLRCT-ND; Order_Code_Farnell: 9239260; Order_Code_RS: N/A
R44 = MCD-00381: Resistor, 1K3, 0402, +/-1%, 1/16W; Part_Preference: Recommended; Manufacturer: YAGEO; Manufacturer_Part_Number: RC0402FR-071K3L; Component_Country_Of_Origin: China; ShowFields: YES; ID: 2898; Internal_Part_Number: MCD-00381; Status: Released; Part_Type: Resistor; Package: 0402; ComponentLink1URL: http://tunmcdsvn.tun.st.com/Component_Documentation_Library/Trunk/Resistor/YAGEO_RC_L_Series; Order_Code_Digikey: YAG3036CT-ND; Order_Code_Farnell: 1799176; Order_Code_RS: N/A
R45 = MCD-02455: Resistor, 3K9, 0402, +/-1%, 1/16W, +/-100ppm/°C; Part_Preference: Recommended; Manufacturer: YAGEO; Manufacturer_Part_Number: RC0402FR-073K9L; Order_Code_RS: 198-7783; Component_Country_Of_Origin: China; ShowFields: YES; ID: 4561; Internal_Part_Number: MCD-02455; Status: Released; Part_Type: Resistor; Package: 0402; ComponentLink1URL: http://tunmcdsvn.tun.st.com/Component_Documentation_Library/Trunk/Resistor/YAGEO_RC0402_Series; Order_Code_Digikey: 311-3.90KLRTR-ND; Order_Code_Farnell: 9239308
R56 R58 = MCD-00455: Resistor, 33R, 0402, +/-1%, 1/16W; Part_Preference: Recommended; Manufacturer: YAGEO; Manufacturer_Part_Number: RC0402FR-0733RL; Component_Country_Of_Origin: China; ShowFields: YES; ID: 2821; Internal_Part_Number: MCD-00455; Status: Released; Part_Type: Resistor; Package: 0402; ComponentLink1URL: http://tunmcdsvn.tun.st.com/Component_Documentation_Library/Trunk/Resistor/YAGEO_RC_L_Series; Order_Code_Digikey: 311-33.0LRCT-ND; Order_Code_Farnell: 9239057; Order_Code_RS: N/A
TP1 = MCD-00074: Test Point 1mm; Part_Type: Mechanical; Internal_Part_Number: MCD-00074; Status: Released; Provided_By: n/a; Manufacturer_Part_Number: n/a; Manufacturer: n/a; ComponentLink1Description: Datasheet; ComponentLink1URL: http://na
U5 = MCD-02706: MCU, ARM Cortex-M7 32-bit, 512KB Flash, 276KB RAM, With Crypto; BMS_Part_Number: 9175300; Part_Type: IC; Part_Preference: Not recommended; Manufacturer: STMICROELECTRONICS; Order_Code_RS: 135-8241; ShowFields: YES; ID: 4812; Internal_Part_Number: MCD-02706; Status: Checked; Manufacturer_Part_Number: STM32F723IEK6; Package: BGA-176; ComponentLink1URL: http://tunmcdsvn.tun.st.com/Component_Documentation_Library/Trunk/IC/STMICROELECTRONICS_STM32F723IEK6; Order_Code_Digikey: 497-17186-ND; Order_Code_Farnell: 2725149
U6 U9 U15 = MCD-01945: 4-bit dual supply translating transceiver with configurable voltage translation; 3-state; Part_Type: IC; Manufacturer_Part_Number: 74AVC4TD245BQ,115; Manufacturer: NEXPERIA; Part_Preference: Recommended; Internal_Part_Number: MCD-01945; Value: 74AVC4TD245BQ; Status: Released; Package: DHVQFN16; ComponentLink1URL: http://tunmcdsvn.tun.st.com/Component_Datasheet_Library/Trunk/IC/NEXPERIA_dual supply transceiver_74AVC4TD245; Order_Code_Digikey: 1727-6899-1-ND; Order_Code_Farnell: N/A; Order_Code_RS: N/A; Alternate_Manufacturer: N/A
U7 = MCD-01207: High power Transient voltage suppressor:25V/35A EOS and ESD transients protection.; Part_Type: Diode; Manufacturer: STMICROELECTRONICS; BMS_Part_Number: 9179045; ECCN_US: EAR99; ECCN_EU: NEC; Provided_By: SUBCO with ST control; Internal_Part_Number: MCD-01207; Status: Checked; Manufacturer_Part_Number: ESDA25P35-1U1M; Package: QFN1610; ComponentLink1Description: Datasheet; ComponentLink1URL: http://tunmcdsvn.tun.st.com/Component_Datasheet_Library/Trunk/Diodes/STM_ESD_ESDA25P35-1U1M
U8 = MCD-00649: Common mode filter with ESD protection for USB 2.0 interface; BMS_Part_Number: 9151138; Part_Type: Diode; Part_Preference: Recommended; Manufacturer: STMICROELECTRONICS; Manufacturer_HQ_COO: EU; Component_Country_Of_Origin: China; ShowFields: YES; ID: 3094; Internal_Part_Number: MCD-00649; Value: ECMF02-2AMX6; Status: Released; Manufacturer_Part_Number: ECMF02-2AMX6; ComponentLink1URL: http://tunmcdsvn.tun.st.com/Component_Datasheet_Library/Trunk/Diodes/STM_ESD_ECMF02-2AMX6
U10 = MCD-02532: IC, 2V7 to 18V, 4A, 34mR, eFuse with fast overvoltage protection; Part_Preference: Recommended; Manufacturer: TEXAS INSTRUMENTS; Component_Country_Of_Origin: Thailand; ShowFields: YES; ID: 4638; Internal_Part_Number: MCD-02532; Value: TPS259535DSG; Status: Checked; Part_Type: IC; Manufacturer_Part_Number: TPS259535DSG; Package: WSON-8; ComponentLink1URL: http://tunmcdsvn.tun.st.com/Component_Documentation_Library/Trunk/IC/TEXAS_INSTRUMENTS_TPS259535DSG; Order_Code_Digikey: N/A; Order_Code_Farnell: N/A; Order_Code_RS: N/A
U11 = MCD-02514: LDO, 3.3V, 300mA, High input voltage: 2.5V to 28V, SOT23-5L; Part_Type: IC; Part_Preference: Recommended; Manufacturer: STMICROELECTRONICS; Internal_Part_Number: MCD-02514; Value: ST730M33R; BMS_Part_Number: N/A; Status: New; Manufacturer_Part_Number: ST730M33R; Alternate_Manufacturer: N/A; Alternate_Manufacturer_Part_Number: N/A; Package: SOT23-5L; ComponentLink1URL: http://tunmcdsvn.tun.st.com/Component_Documentation_Library/Trunk/IC/STMICROELECTRONICS_ST730M33R; Order_Code_Digikey: N/A; Order_Code_Farnell: N/A; Order_Code_RS: N/A
U12 = MCD-00159: 500mA, Enhanced single channel power switches with active high enable pin; BMS_Part_Number: 9159009; Part_Type: IC; Part_Preference: Recommended; Manufacturer: STMICROELECTRONICS; Manufacturer_HQ_COO: EU; Component_Country_Of_Origin: Malaysia; ShowFields: YES; ID: 2708; Internal_Part_Number: MCD-00159; Value: STMPS2151STR; Status: Released; Manufacturer_Part_Number: STMPS2151STR; ComponentLink1URL: http://tunmcdsvn.tun.st.com/Component_Datasheet_Library/Trunk/IC/STM_PWR-Switch_STMPS2151STR
X1 = MCD-01036: Crystal, 24MHz, 6pF, +/-20ppm, 80R, 2x1.6mm; BMS_Part_Number: 9157045; Part_Type: Crystal_Osc; Part_Preference: Recommended; Manufacturer: NDK; Manufacturer_Part_Number: NX2016SA-24MHZ-EXS00A-CS10820; Component_Country_Of_Origin: Unknown; Internal_Part_Number: MCD-01036; Status: Released; Package: 2x1.6mm; ComponentLink1URL: http://tunmcdsvn.tun.st.com/Component_Documentation_Library/Trunk/Crytal_Oscillator/NDK_NX2016SA_Series; Order_Code_Digikey: 644-1365; Order_Code_Farnell: N/A; Order_Code_RS: N/A